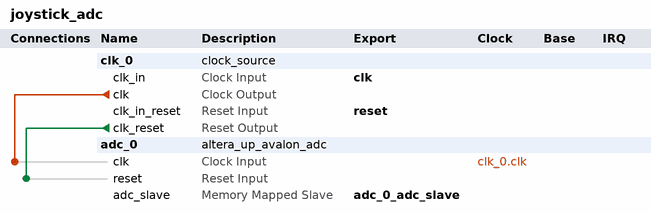
[diagram p0: system contents]
# Platform Designer (Qsys) system joystick_adc, MAX 10 10M50DAF484C6GES
# Parameters at their usual value, and those the tool derives, are not listed.
package require -exact qsys 20.1
create_system joystick_adc
set_project_property DEVICE_FAMILY {MAX 10}
set_project_property DEVICE 10M50DAF484C6GES

add_instance clk_0 clock_source 20.1
set_instance_parameter_value clk_0 clockFrequency 50000000

add_instance adc_0 altera_up_avalon_adc 18.0
set_instance_parameter_value adc_0 board DE10-Lite
set_instance_parameter_value adc_0 numch_ 6
set_instance_parameter_value adc_0 sclk_freq 10.0

# connections
add_connection clk_0.clk adc_0.clk clock
add_connection clk_0.clk_reset adc_0.reset reset

# exported interfaces
add_interface adc_0_adc_slave avalon slave
set_interface_property adc_0_adc_slave EXPORT_OF adc_0.adc_slave
add_interface clk clock sink
set_interface_property clk EXPORT_OF clk_0.clk_in
add_interface reset reset sink
set_interface_property reset EXPORT_OF clk_0.clk_in_reset

set_interconnect_requirement {$system} qsys_mm.clockCrossingAdapter HANDSHAKE
set_interconnect_requirement {$system} qsys_mm.enableEccProtection FALSE
set_interconnect_requirement {$system} qsys_mm.insertDefaultSlave FALSE
set_interconnect_requirement {$system} qsys_mm.maxAdditionalLatency 1

save_system joystick_adc.qsys
